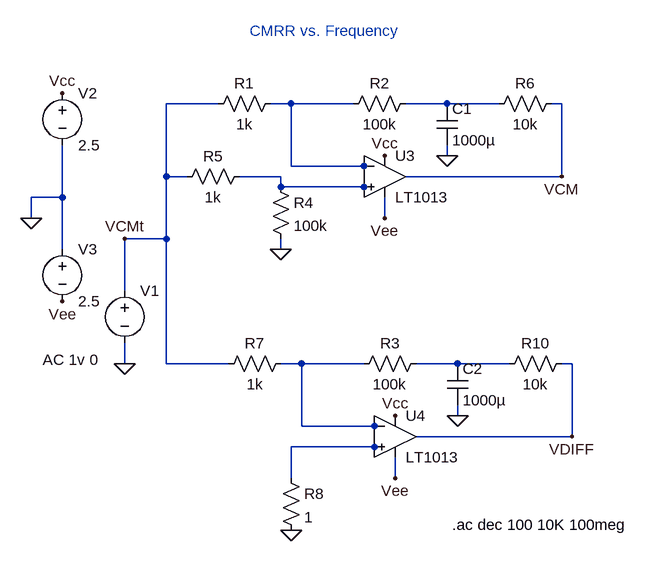
[diagram p0: schematic CMRR.asc]
CMRR.asc, the LTspice schematic file:
Version 4
SHEET 1 1072 680
WIRE -160 -128 -240 -128
WIRE -48 -128 -80 -128
WIRE 48 -128 -48 -128
WIRE 192 -128 128 -128
WIRE 272 -128 192 -128
WIRE 368 -128 352 -128
WIRE 192 -48 192 -64
WIRE -48 -32 -48 -128
WIRE 64 -32 -48 -32
WIRE 80 -32 64 -32
WIRE -240 -16 -240 -128
WIRE -208 -16 -240 -16
WIRE -64 -16 -128 -16
WIRE 368 -16 368 -128
WIRE 368 -16 128 -16
WIRE -64 0 -64 -16
WIRE 64 0 -64 0
WIRE 80 0 64 0
WIRE -400 16 -400 -64
WIRE -400 16 -448 16
WIRE -448 48 -448 16
WIRE 96 48 96 16
WIRE -240 80 -240 -16
WIRE -240 80 -304 80
WIRE -400 96 -400 16
WIRE -64 96 -64 80
WIRE -304 160 -304 80
WIRE -304 272 -304 240
WIRE -240 272 -240 80
WIRE -144 272 -240 272
WIRE -32 272 -64 272
WIRE 64 272 -32 272
WIRE 208 272 144 272
WIRE 288 272 208 272
WIRE 384 272 368 272
WIRE 208 352 208 336
WIRE -32 368 -32 272
WIRE 80 368 -32 368
WIRE 96 368 80 368
WIRE 384 384 384 272
WIRE 384 384 144 384
WIRE 80 400 -48 400
WIRE 96 400 80 400
WIRE -48 448 -48 400
WIRE 112 448 112 416
FLAG -448 48 0
FLAG -400 -144 Vcc
FLAG 96 -48 Vcc
FLAG -400 176 Vee
FLAG 96 48 Vee
FLAG -304 272 0
FLAG -64 96 0
FLAG 192 -48 0
FLAG 112 352 Vcc
FLAG 112 448 Vee
FLAG -48 528 0
FLAG 208 352 0
FLAG -304 80 VCMt
FLAG 368 -16 VCM
FLAG 384 384 VDIFF
SYMBOL voltage -304 144 R0
WINDOW 3 -136 217 Left 0
WINDOW 123 -126 122 Left 0
WINDOW 39 0 0 Left 0
SYMATTR Value ""
SYMATTR Value2 AC 1v 0
SYMATTR InstName V1
SYMBOL voltage -400 -160 R0
WINDOW 123 0 0 Left 0
WINDOW 39 0 0 Left 0
SYMATTR InstName V2
SYMATTR Value 2.5
SYMBOL voltage -400 80 R0
WINDOW 123 0 0 Left 0
WINDOW 39 0 0 Left 0
SYMATTR InstName V3
SYMATTR Value 2.5
SYMBOL res 144 -144 R90
WINDOW 0 0 56 VBottom 0
WINDOW 3 32 56 VTop 0
SYMATTR InstName R2
SYMATTR Value 100k
SYMBOL res -64 -144 R90
WINDOW 0 0 56 VBottom 0
WINDOW 3 32 56 VTop 0
SYMATTR InstName R1
SYMATTR Value 1k
SYMBOL res -80 -16 R0
SYMATTR InstName R4
SYMATTR Value 100k
SYMBOL res -112 -32 R90
WINDOW 0 0 56 VBottom 0
WINDOW 3 32 56 VTop 0
SYMATTR InstName R5
SYMATTR Value 1k
SYMBOL res 256 -112 R270
WINDOW 0 32 56 VTop 0
WINDOW 3 0 56 VBottom 0
SYMATTR InstName R6
SYMATTR Value 10k
SYMBOL cap 176 -128 R0
SYMATTR InstName C1
SYMATTR Value 1000µ
SYMBOL res 160 256 R90
WINDOW 0 0 56 VBottom 0
WINDOW 3 32 56 VTop 0
SYMATTR InstName R3
SYMATTR Value 100k
SYMBOL res -48 256 R90
WINDOW 0 0 56 VBottom 0
WINDOW 3 32 56 VTop 0
SYMATTR InstName R7
SYMATTR Value 1k
SYMBOL res -64 432 R0
SYMATTR InstName R8
SYMATTR Value 1
SYMBOL res 272 288 R270
WINDOW 0 32 56 VTop 0
WINDOW 3 0 56 VBottom 0
SYMATTR InstName R10
SYMATTR Value 10k
SYMBOL cap 192 272 R0
SYMATTR InstName C2
SYMATTR Value 1000µ
SYMBOL Opamps\\LT1013 96 -80 R0
SYMATTR InstName U3
SYMBOL Opamps\\LT1013 112 320 R0
SYMATTR InstName U4
TEXT 200 520 Left 0 !.ac dec 100 10K 100meg
TEXT -112 -240 Left 0 ;CMRR vs. Frequency

The netlist it stands for:
* CMRR.asc
V1 VCMt 0 AC 1v 0
V2 Vcc 0 2.5
V3 0 Vee 2.5
R2 N002 N001 100k
R1 N001 VCMt 1k
R4 N003 0 100k
R5 N003 VCMt 1k
R6 N002 VCM 10k
C1 N002 0 1000µ
R3 N005 N004 100k
R7 N004 VCMt 1k
R8 N006 0 1
R10 N005 VDIFF 10k
C2 N005 0 1000µ
XU3 N003 N001 Vcc Vee VCM LT1013  ; pins In+ In- V+ V- OUT
XU4 N006 N004 Vcc Vee VDIFF LT1013  ; pins In+ In- V+ V- OUT
.ac dec 100 10K 100meg
* CMRR vs. Frequency
.lib LTC.lib
.backanno
.end